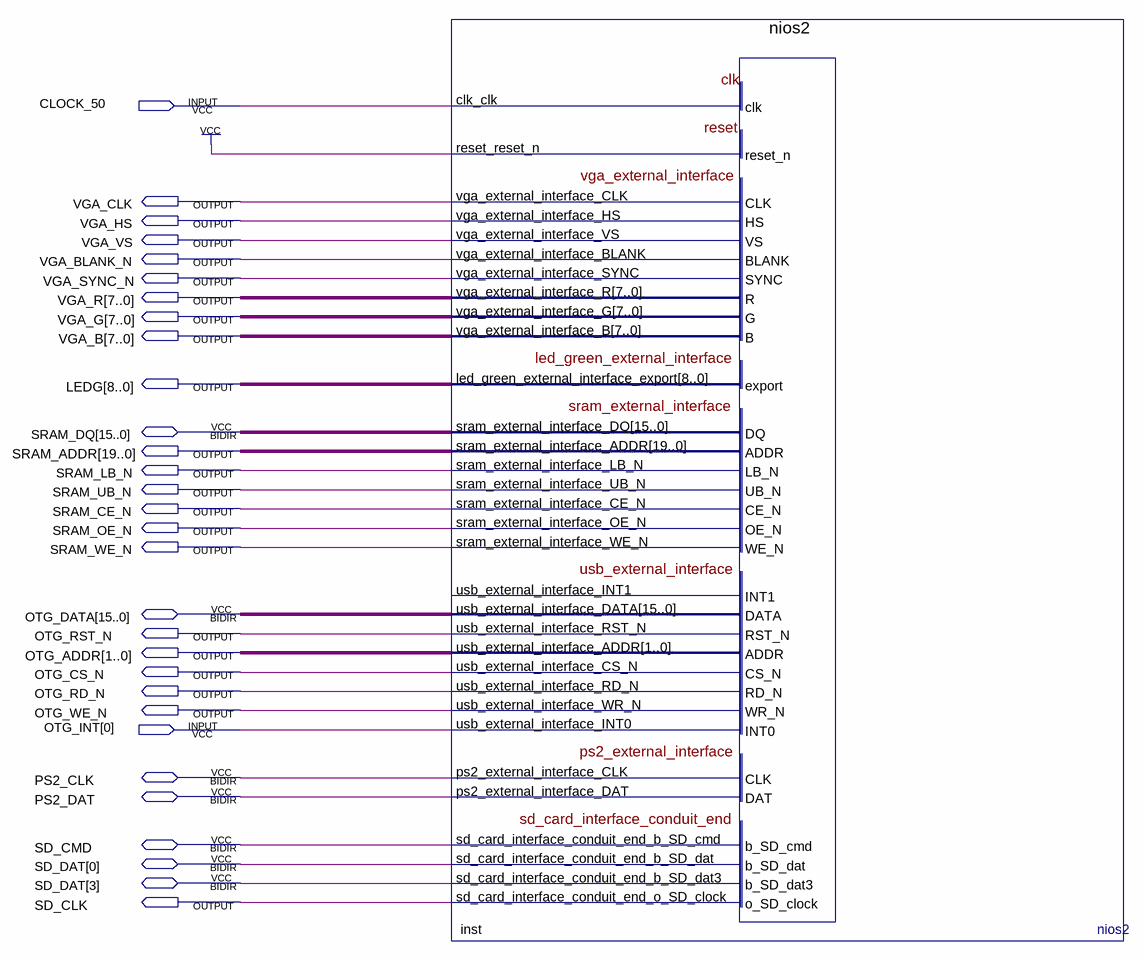
[diagram p0: schematic sheet]
// Quartus schematic MSB.bdf as structural Verilog: 1 symbols, 30 pins
module MSB (
  input  CLOCK_50,
  input  [0:0] OTG_INT,
  inout  [15:0] SRAM_DQ,
  inout  [15:0] OTG_DATA,
  inout  PS2_CLK,
  inout  PS2_DAT,
  inout  SD_CMD,
  inout  [3:0] SD_DAT,
  output VGA_CLK,
  output VGA_HS,
  output VGA_VS,
  output VGA_BLANK_N,
  output VGA_SYNC_N,
  output [7:0] VGA_R,
  output [7:0] VGA_G,
  output [7:0] VGA_B,
  output [8:0] LEDG,
  output [19:0] SRAM_ADDR,
  output SRAM_LB_N,
  output SRAM_UB_N,
  output SRAM_CE_N,
  output SRAM_OE_N,
  output SRAM_WE_N,
  output OTG_RST_N,
  output [1:0] OTG_ADDR,
  output OTG_CS_N,
  output OTG_RD_N,
  output OTG_WE_N,
  output SD_CLK
);

  nios2 inst (
    .clk_clk(CLOCK_50), .reset_reset_n(1'b1), .usb_external_interface_INT0(OTG_INT[0]),
    .vga_external_interface_CLK(VGA_CLK), .vga_external_interface_HS(VGA_HS),
    .vga_external_interface_VS(VGA_VS), .vga_external_interface_BLANK(VGA_BLANK_N),
    .vga_external_interface_SYNC(VGA_SYNC_N), .vga_external_interface_R(VGA_R),
    .vga_external_interface_G(VGA_G), .vga_external_interface_B(VGA_B),
    .led_green_external_interface_export(LEDG), .sram_external_interface_ADDR(SRAM_ADDR),
    .sram_external_interface_LB_N(SRAM_LB_N), .sram_external_interface_UB_N(SRAM_UB_N),
    .sram_external_interface_CE_N(SRAM_CE_N), .sram_external_interface_OE_N(SRAM_OE_N),
    .sram_external_interface_WE_N(SRAM_WE_N), .usb_external_interface_RST_N(OTG_RST_N),
    .usb_external_interface_ADDR(OTG_ADDR), .usb_external_interface_CS_N(OTG_CS_N),
    .usb_external_interface_RD_N(OTG_RD_N), .usb_external_interface_WR_N(OTG_WE_N),
    .sd_card_interface_conduit_end_o_SD_clock(SD_CLK), .sram_external_interface_DQ(SRAM_DQ),
    .usb_external_interface_DATA(OTG_DATA), .ps2_external_interface_CLK(PS2_CLK),
    .ps2_external_interface_DAT(PS2_DAT), .sd_card_interface_conduit_end_b_SD_cmd(SD_CMD),
    .sd_card_interface_conduit_end_b_SD_dat(SD_DAT[0]), .sd_card_interface_conduit_end_b_SD_dat3(SD_DAT[3]));  // open: usb_external_interface_INT1
endmodule
